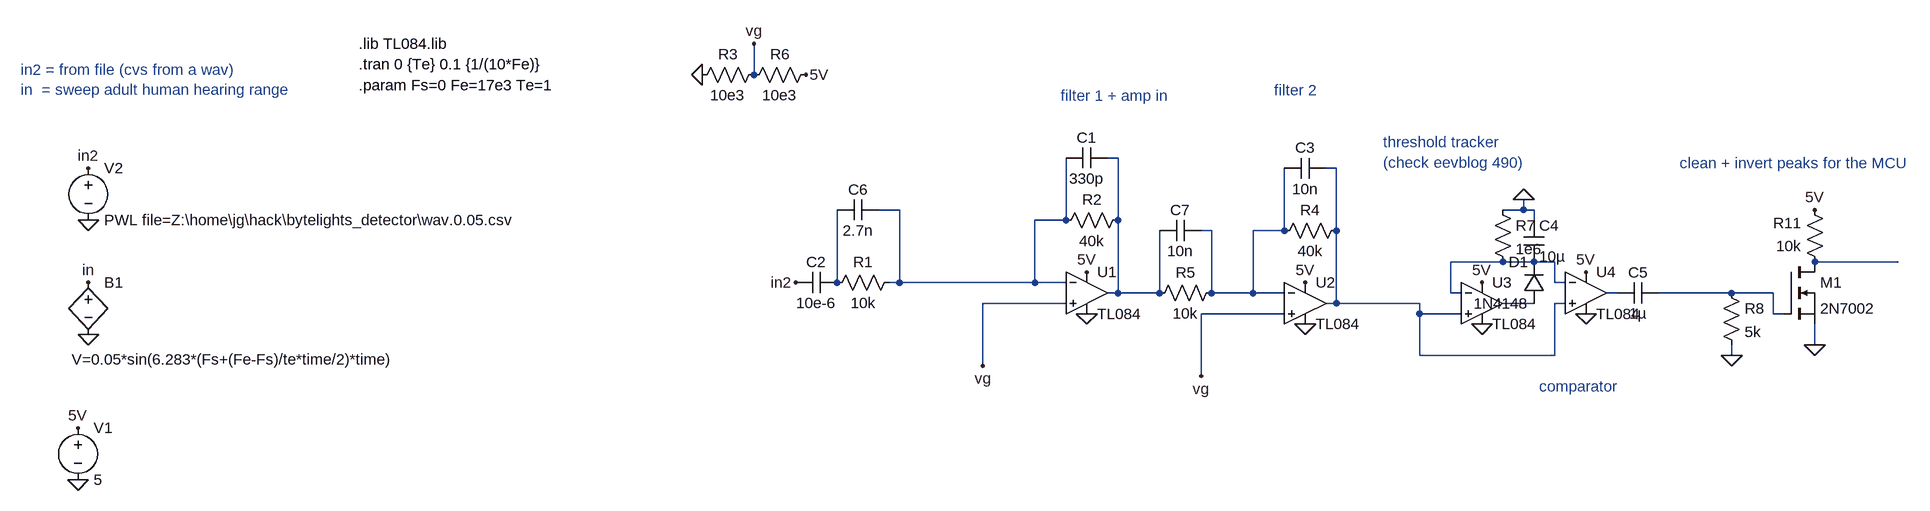
[diagram p0: schematic hihat_detector.asc]
hihat_detector.asc, the LTspice schematic file:
Version 4
SHEET 1 1768 680
WIRE -160 -336 -160 -384
WIRE 400 -208 384 -208
WIRE 736 -192 720 -192
WIRE 64 -128 32 -128
WIRE 1024 -128 1024 -144
WIRE 1024 -128 992 -128
WIRE 1040 -128 1024 -128
WIRE 64 -16 64 -128
WIRE 320 -112 320 -208
WIRE 320 -112 272 -112
WIRE 400 -112 400 -208
WIRE 1040 -112 1040 -128
WIRE 544 -96 528 -96
WIRE 656 -96 656 -192
WIRE 656 -96 608 -96
WIRE 736 -96 736 -192
WIRE 992 -48 912 -48
WIRE 1040 -48 992 -48
WIRE 1072 -48 1040 -48
WIRE 1600 -48 1472 -48
WIRE -32 -16 -32 -128
WIRE 64 -16 48 -16
WIRE 272 -16 272 -112
WIRE 272 -16 64 -16
WIRE 320 -16 272 -16
WIRE 1072 -16 1072 -48
WIRE 1088 -16 1072 -16
WIRE 400 0 400 -112
WIRE 400 0 384 0
WIRE 464 0 464 -96
WIRE 464 0 400 0
WIRE 544 0 544 -96
WIRE 608 0 608 -96
WIRE 608 0 544 0
WIRE 656 0 608 0
WIRE 912 0 912 -48
WIRE 928 0 912 0
WIRE 1168 0 1152 0
WIRE 1344 0 1232 0
WIRE 1408 0 1344 0
WIRE 320 16 192 16
WIRE 736 16 736 -96
WIRE 736 16 720 16
WIRE 864 16 736 16
WIRE 1040 16 992 16
WIRE 1088 16 1072 16
WIRE 656 32 528 32
WIRE 864 32 864 16
WIRE 928 32 864 32
WIRE 1408 32 1408 0
WIRE 1424 32 1408 32
WIRE 1472 80 1472 48
WIRE 864 96 864 32
WIRE 1072 96 1072 16
WIRE 1072 96 864 96
WIRE 1344 96 1344 80
WIRE 192 112 192 16
WIRE 528 128 528 32
FLAG -1200 288 0
FLAG -1200 208 5V
FLAG -1184 64 0
FLAG -1184 -16 in
FLAG 352 32 0
FLAG 352 -32 5V
FLAG -96 -16 in2
FLAG -80 -336 5V
FLAG -240 -336 0
FLAG -160 -384 vg
FLAG 192 112 vg
FLAG -1184 -112 0
FLAG -1184 -192 in2
FLAG 688 48 0
FLAG 688 -16 5V
FLAG 528 128 vg
FLAG 960 48 0
FLAG 960 -16 5V
FLAG 1120 -32 5V
FLAG 1120 32 0
FLAG 1024 -144 0
FLAG 1472 80 0
FLAG 1472 -128 5V
FLAG 1344 96 0
SYMBOL voltage -1200 192 R0
WINDOW 123 0 0 Left 0
WINDOW 39 0 0 Left 0
SYMATTR InstName V1
SYMATTR Value 5
SYMBOL bv -1184 -32 R0
WINDOW 3 -26 134 Left 2
SYMATTR Value V=0.05*sin(6.283*(Fs+(Fe-Fs)/te*time/2)*time)
SYMATTR InstName B1
SYMBOL cap -32 -32 R90
WINDOW 0 0 32 VBottom 2
WINDOW 3 32 32 VTop 2
SYMATTR InstName C2
SYMATTR Value 10e-6
SYMBOL OpAmps\\opamp2 352 -64 R0
SYMATTR InstName U1
SYMATTR Value TL084
SYMBOL res -144 -352 R90
WINDOW 0 0 56 VBottom 2
WINDOW 3 32 56 VTop 2
SYMATTR InstName R3
SYMATTR Value 10e3
SYMBOL res -64 -352 R90
WINDOW 0 0 56 VBottom 2
WINDOW 3 32 56 VTop 2
SYMATTR InstName R6
SYMATTR Value 10e3
SYMBOL res 64 -32 R90
WINDOW 0 0 56 VBottom 2
WINDOW 3 32 56 VTop 2
SYMATTR InstName R1
SYMATTR Value 10k
SYMBOL res 416 -128 R90
WINDOW 0 0 56 VBottom 2
WINDOW 3 32 56 VTop 2
SYMATTR InstName R2
SYMATTR Value 40k
SYMBOL cap 384 -224 R90
WINDOW 0 0 32 VBottom 2
WINDOW 3 32 32 VTop 2
SYMATTR InstName C1
SYMATTR Value 330p
SYMBOL OpAmps\\opamp2 688 -48 R0
SYMATTR InstName U2
SYMATTR Value TL084
SYMBOL res 752 -112 R90
WINDOW 0 0 56 VBottom 2
WINDOW 3 32 56 VTop 2
SYMATTR InstName R4
SYMATTR Value 40k
SYMBOL cap 720 -208 R90
WINDOW 0 0 32 VBottom 2
WINDOW 3 32 32 VTop 2
SYMATTR InstName C3
SYMATTR Value 10n
SYMBOL res 560 -16 R90
WINDOW 0 0 56 VBottom 2
WINDOW 3 32 56 VTop 2
SYMATTR InstName R5
SYMATTR Value 10k
SYMBOL voltage -1184 -208 R0
WINDOW 123 0 0 Left 0
WINDOW 39 0 0 Left 0
SYMATTR InstName V2
SYMATTR Value PWL file=Z:\home\jg\hack\bytelights_detector\wav.0.05.csv
SYMBOL OpAmps\\opamp2 960 -48 R0
SYMATTR InstName U3
SYMATTR Value TL084
SYMBOL OpAmps\\opamp2 1120 -64 R0
SYMATTR InstName U4
SYMATTR Value TL084
SYMBOL diode 1056 16 R180
WINDOW 0 24 64 Left 2
WINDOW 3 24 0 Left 2
SYMATTR InstName D1
SYMATTR Value 1N4148
SYMBOL cap 1024 -112 R0
SYMATTR InstName C4
SYMATTR Value 10µ
SYMBOL res 976 -144 R0
SYMATTR InstName R7
SYMATTR Value 1e6
SYMBOL cap 1232 -16 R90
WINDOW 0 0 32 VBottom 2
WINDOW 3 32 32 VTop 2
SYMATTR InstName C5
SYMATTR Value 1µ
SYMBOL res 1488 -32 R180
WINDOW 0 36 76 Left 2
WINDOW 3 36 40 Left 2
SYMATTR InstName R11
SYMATTR Value 10k
SYMBOL nmos 1424 -48 R0
SYMATTR InstName M1
SYMATTR Value 2N7002
SYMBOL res 1328 -16 R0
SYMATTR InstName R8
SYMATTR Value 5k
SYMBOL cap 32 -144 R90
WINDOW 0 0 32 VBottom 2
WINDOW 3 32 32 VTop 2
SYMATTR InstName C6
SYMATTR Value 2.7n
SYMBOL cap 528 -112 R90
WINDOW 0 0 32 VBottom 2
WINDOW 3 32 32 VTop 2
SYMATTR InstName C7
SYMATTR Value 10n
TEXT -768 -352 Left 2 !.tran 0 {Te} 0.1 {1/(10*Fe)}
TEXT -768 -320 Left 2 !.param Fs=0 Fe=17e3 Te=1
TEXT -768 -384 Left 2 !.lib TL084.lib
TEXT -1288 -344 Left 2 ;in2 = from file (cvs from a wav)\nin  = sweep adult human hearing range
TEXT 312 -304 Left 2 ;filter 1 + amp in
TEXT 640 -312 Left 2 ;filter 2
TEXT 808 -232 Left 2 ;threshold tracker \n(check eevblog 490)
TEXT 1048 144 Left 2 ;comparator
TEXT 1264 -200 Left 2 ;clean + invert peaks for the MCU

The netlist it stands for:
* hihat_detector.asc
V1 5V 0 5
B1 in 0 V=0.05*sin(6.283*(Fs+(Fe-Fs)/te*time/2)*time)
C2 N007 in2 10e-6
XU1 vg N003 5V 0 N001 TL084  ; pins In+ In- V+ V- OUT
R3 vg 0 10e3
R6 5V vg 10e3
R1 N003 N007 10k
R2 N001 N003 40k
C1 N001 N003 330p
XU2 vg N004 5V 0 N002 TL084  ; pins In+ In- V+ V- OUT
R4 N002 N004 40k
C3 N002 N004 10n
R5 N004 N001 10k
V2 in2 0 PWL file=Z:\home\jg\hack\bytelights_detector\wav.0.05.csv
XU3 N002 N005 5V 0 N010 TL084  ; pins In+ In- V+ V- OUT
XU4 N002 N005 5V 0 N008 TL084  ; pins In+ In- V+ V- OUT
D1 N010 N005 1N4148
C4 0 N005 10µ
R7 0 N005 1e6
C5 N009 N008 1µ
R11 N006 5V 10k
M1 N006 N009 0 0 2N7002
R8 N009 0 5k
C6 N003 N007 2.7n
C7 N004 N001 10n
.model D D
.lib standard.dio
.model NMOS NMOS
.model PMOS PMOS
.lib standard.mos
.tran 0 {Te} 0.1 {1/(10*Fe)}
.param Fs=0 Fe=17e3 Te=1
.lib TL084.lib
* in2 = from file (cvs from a wav)
* in  = sweep adult human hearing range
* filter 1 + amp in
* filter 2
* threshold tracker
* (check eevblog 490)
* comparator
* clean + invert peaks for the MCU
.backanno
.end